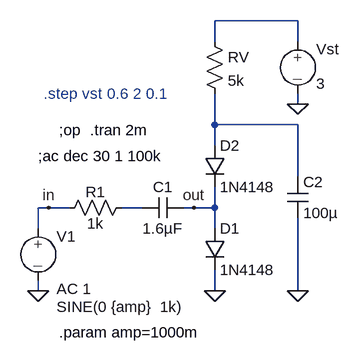
[diagram p0: schematic elektron-poti.asc]
elektron-poti.asc, the LTspice schematic file:
Version 4
SHEET 1 880 680
WIRE 448 -128 320 -128
WIRE 320 -96 320 -128
WIRE 448 -96 448 -128
WIRE 448 0 448 -16
WIRE 320 32 320 -16
WIRE 448 32 320 32
WIRE 320 64 320 32
WIRE 448 112 448 32
WIRE 64 160 48 160
WIRE 96 160 64 160
WIRE 208 160 176 160
WIRE 288 160 272 160
WIRE 320 160 320 128
WIRE 320 160 288 160
WIRE 48 192 48 160
WIRE 320 192 320 160
WIRE 48 288 48 272
WIRE 320 288 320 256
WIRE 448 288 448 176
FLAG 448 0 0
FLAG 320 288 0
FLAG 48 288 0
FLAG 288 160 out
FLAG 64 160 in
FLAG 448 288 0
SYMBOL source-V 48 176 R0
WINDOW 3 28 137 Left 2
WINDOW 123 28 109 Left 2
WINDOW 39 0 0 Left 2
SYMATTR InstName V1
SYMATTR Value SINE(0 {amp}  1k)
SYMATTR Value2 AC 1
SYMBOL source-V 448 -112 R0
SYMATTR InstName Vst
SYMATTR Value 3
SYMBOL diode 304 192 R0
SYMATTR InstName D1
SYMATTR Value 1N4148
SYMBOL res 304 -112 R0
SYMATTR InstName RV
SYMATTR Value 5k
SYMBOL cap 208 176 R270
WINDOW 0 32 32 VTop 2
WINDOW 3 0 32 VBottom 2
SYMATTR InstName C1
SYMATTR Value 1.6µF
SYMBOL res 80 176 R270
WINDOW 0 25 56 VTop 2
WINDOW 3 7 56 VBottom 2
SYMATTR InstName R1
SYMATTR Value 1k
SYMBOL diode 304 64 R0
SYMATTR InstName D2
SYMATTR Value 1N4148
SYMBOL cap 432 112 R0
SYMATTR InstName C2
SYMATTR Value 100µ
TEXT 80 40 Left 2 !;op
TEXT 48 80 Left 2 !;ac dec 30 1 100k
TEXT 56 -16 Left 2 ;.step vst 0.6 2 0.1
TEXT 80 352 Left 2 !.param amp=1000m
TEXT 128 40 Left 2 !.tran 2m

The netlist it stands for:
* elektron-poti.asc
V1 in 0 SINE(0 {amp}  1k) AC 1
Vst N001 0 3
D1 out 0 1N4148
RV N001 N002 5k
C1 N003 out 1.6µF
R1 in N003 1k
D2 N002 out 1N4148
C2 N002 0 100µ
.model D D
.lib standard.dio
;op
;ac dec 30 1 100k
* .step vst 0.6 2 0.1
.param amp=1000m
.tran 2m
.backanno
.end